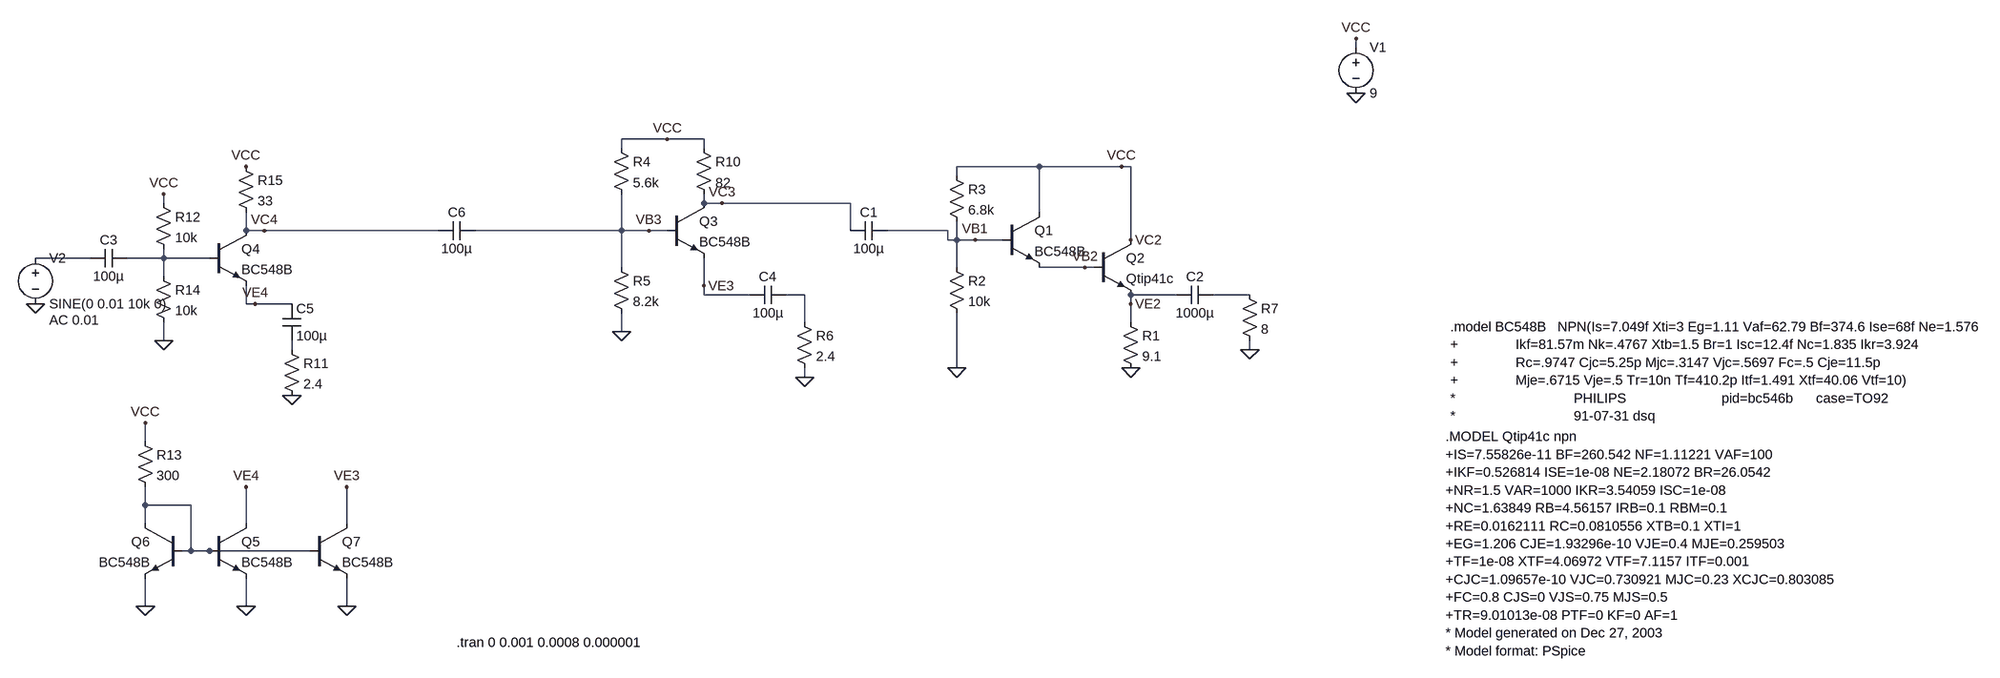
[diagram p0: schematic TL4-Funes.asc]
TL4-Funes.asc, the LTspice schematic file:
Version 4
SHEET 1 1936 816
WIRE 624 -240 624 -256
WIRE -688 -80 -768 -80
WIRE -624 -80 -688 -80
WIRE -768 -64 -768 -80
WIRE -624 -64 -624 -80
WIRE 32 -32 -112 -32
WIRE 176 -32 32 -32
WIRE 192 -32 176 -32
WIRE -112 -16 -112 -32
WIRE -1568 32 -1568 16
WIRE -624 32 -624 16
WIRE -592 32 -624 32
WIRE -368 32 -592 32
WIRE 32 48 32 -32
WIRE -1424 80 -1424 48
WIRE -1392 80 -1424 80
WIRE -1088 80 -1392 80
WIRE -768 80 -768 16
WIRE -768 80 -1024 80
WIRE -720 80 -768 80
WIRE -688 80 -720 80
WIRE -368 80 -368 32
WIRE -128 80 -304 80
WIRE -128 96 -128 80
WIRE -112 96 -112 64
WIRE -112 96 -128 96
WIRE -80 96 -112 96
WIRE -32 96 -80 96
WIRE 192 96 192 -32
WIRE -1696 128 -1792 128
WIRE -1568 128 -1568 112
WIRE -1568 128 -1632 128
WIRE -1488 128 -1568 128
WIRE -768 144 -768 80
WIRE -112 144 -112 96
WIRE 112 144 32 144
WIRE 128 144 112 144
WIRE -1568 160 -1568 128
WIRE -624 176 -624 128
WIRE -624 192 -624 176
WIRE -544 192 -624 192
WIRE -448 192 -480 192
WIRE 272 192 192 192
WIRE 400 192 336 192
WIRE -1424 208 -1424 176
WIRE -1408 208 -1424 208
WIRE -1344 208 -1408 208
WIRE 192 208 192 192
WIRE -448 240 -448 192
WIRE 192 240 192 208
WIRE -768 256 -768 224
WIRE -1568 272 -1568 240
WIRE -1344 288 -1344 272
WIRE 400 288 400 272
WIRE -112 320 -112 224
WIRE -448 336 -448 320
WIRE -1600 448 -1600 416
WIRE -1600 560 -1600 528
WIRE -1520 560 -1600 560
WIRE -1600 592 -1600 560
WIRE -1424 592 -1424 528
WIRE -1248 592 -1248 528
WIRE -1520 640 -1520 560
WIRE -1520 640 -1536 640
WIRE -1488 640 -1520 640
WIRE -1312 640 -1488 640
WIRE -1600 736 -1600 688
WIRE -1424 736 -1424 688
WIRE -1248 736 -1248 688
FLAG 624 -160 0
FLAG 624 -256 VCC
FLAG 176 -32 VCC
FLAG 192 320 0
FLAG -112 320 0
FLAG 112 144 VB2
FLAG -80 96 VB1
FLAG 192 208 VE2
FLAG -768 256 0
FLAG -688 -80 VCC
FLAG -720 80 VB3
FLAG 400 288 0
FLAG 192 96 VC2
FLAG -592 32 VC3
FLAG -624 176 VE3
FLAG -1600 736 0
FLAG -1424 736 0
FLAG -1600 416 VCC
FLAG -1424 528 VE4
FLAG -1408 208 VE4
FLAG -1344 368 0
FLAG -1568 16 VCC
FLAG -1568 272 0
FLAG -1424 -32 VCC
FLAG -1392 80 VC4
FLAG -1792 208 0
FLAG -1248 736 0
FLAG -1248 528 VE3
FLAG -448 336 0
SYMBOL npn 128 96 R0
SYMATTR InstName Q2
SYMATTR Value Qtip41c
SYMBOL npn -32 48 R0
SYMATTR InstName Q1
SYMATTR Value BC548B
SYMBOL voltage 624 -256 R0
WINDOW 123 0 0 Left 2
WINDOW 39 0 0 Left 2
SYMATTR InstName V1
SYMATTR Value 9
SYMBOL res 176 224 R0
SYMATTR InstName R1
SYMATTR Value 9.1
SYMBOL res -128 128 R0
SYMATTR InstName R2
SYMATTR Value 10k
SYMBOL res -128 -32 R0
SYMATTR InstName R3
SYMATTR Value 6.8k
SYMBOL npn -688 32 R0
SYMATTR InstName Q3
SYMATTR Value BC548B
SYMBOL res -784 -80 R0
SYMATTR InstName R4
SYMATTR Value 5.6k
SYMBOL res -784 128 R0
SYMATTR InstName R5
SYMATTR Value 8.2k
SYMBOL voltage -1792 112 R0
WINDOW 123 24 124 Left 2
WINDOW 39 0 0 Left 2
SYMATTR Value2 AC 0.01
SYMATTR InstName V2
SYMATTR Value SINE(0 0.01 10k 0)
SYMBOL res 384 176 R0
SYMATTR InstName R7
SYMATTR Value 8
SYMBOL cap 272 208 R270
WINDOW 0 32 32 VTop 2
WINDOW 3 0 32 VBottom 2
SYMATTR InstName C2
SYMATTR Value 1000µ
SYMBOL cap -304 64 R90
WINDOW 0 0 32 VBottom 2
WINDOW 3 32 32 VTop 2
SYMATTR InstName C1
SYMATTR Value 100µ
SYMBOL res -640 -80 R0
SYMATTR InstName R10
SYMATTR Value 82
SYMBOL npn -1488 80 R0
SYMATTR InstName Q4
SYMATTR Value BC548B
SYMBOL npn -1488 592 R0
SYMATTR InstName Q5
SYMATTR Value BC548B
SYMBOL npn -1536 592 M0
SYMATTR InstName Q6
SYMATTR Value BC548B
SYMBOL res -1616 432 R0
SYMATTR InstName R13
SYMATTR Value 300
SYMBOL cap -1360 208 R0
SYMATTR InstName C5
SYMATTR Value 100µ
SYMBOL res -1360 272 R0
SYMATTR InstName R11
SYMATTR Value 2.4
SYMBOL res -1584 16 R0
SYMATTR InstName R12
SYMATTR Value 10k
SYMBOL res -1584 144 R0
SYMATTR InstName R14
SYMATTR Value 10k
SYMBOL res -1440 -48 R0
SYMATTR InstName R15
SYMATTR Value 33
SYMBOL cap -1632 112 R90
WINDOW 0 0 32 VBottom 2
WINDOW 3 32 32 VTop 2
SYMATTR InstName C3
SYMATTR Value 100µ
SYMBOL npn -1312 592 R0
SYMATTR InstName Q7
SYMATTR Value BC548B
SYMBOL cap -544 208 R270
WINDOW 0 32 32 VTop 2
WINDOW 3 0 32 VBottom 2
SYMATTR InstName C4
SYMATTR Value 100µ
SYMBOL res -464 224 R0
SYMATTR InstName R6
SYMATTR Value 2.4
SYMBOL cap -1088 96 R270
WINDOW 0 32 32 VTop 2
WINDOW 3 0 32 VBottom 2
SYMATTR InstName C6
SYMATTR Value 100µ
TEXT 864 440 Left 2 !.MODEL Qtip41c npn\n+IS=7.55826e-11 BF=260.542 NF=1.11221 VAF=100\n+IKF=0.526814 ISE=1e-08 NE=2.18072 BR=26.0542\n+NR=1.5 VAR=1000 IKR=3.54059 ISC=1e-08\n+NC=1.63849 RB=4.56157 IRB=0.1 RBM=0.1\n+RE=0.0162111 RC=0.0810556 XTB=0.1 XTI=1\n+EG=1.206 CJE=1.93296e-10 VJE=0.4 MJE=0.259503\n+TF=1e-08 XTF=4.06972 VTF=7.1157 ITF=0.001\n+CJC=1.09657e-10 VJC=0.730921 MJC=0.23 XCJC=0.803085\n+FC=0.8 CJS=0 VJS=0.75 MJS=0.5\n+TR=9.01013e-08 PTF=0 KF=0 AF=1\n* Model generated on Dec 27, 2003\n* Model format: PSpice
TEXT 872 248 Left 2 !.model BC548B   NPN(Is=7.049f Xti=3 Eg=1.11 Vaf=62.79 Bf=374.6 Ise=68f Ne=1.576\n+               Ikf=81.57m Nk=.4767 Xtb=1.5 Br=1 Isc=12.4f Nc=1.835 Ikr=3.924\n+               Rc=.9747 Cjc=5.25p Mjc=.3147 Vjc=.5697 Fc=.5 Cje=11.5p\n+               Mje=.6715 Vje=.5 Tr=10n Tf=410.2p Itf=1.491 Xtf=40.06 Vtf=10)\n*                               PHILIPS                         pid=bc546b      case=TO92\n*                               91-07-31 dsq
TEXT -1056 800 Left 2 !.tran 0 0.001 0.0008 0.000001

The netlist it stands for:
* TL4-Funes.asc
Q2 VC2 VB2 VE2 0 Qtip41c
Q1 VC2 VB1 VB2 0 BC548B
V1 VC2 0 9
R1 VE2 0 9.1
R2 VB1 0 10k
R3 VC2 VB1 6.8k
Q3 VC3 VB3 VE3 0 BC548B
R4 VC2 VB3 5.6k
R5 VB3 0 8.2k
V2 N001 0 SINE(0 0.01 10k 0) AC 0.01
R7 N004 0 8
C2 VE2 N004 1000µ
C1 VB1 VC3 100µ
R10 VC2 VC3 82
Q4 VC4 N002 VE4 0 BC548B
Q5 VE4 N006 0 0 BC548B
Q6 N006 N006 0 0 BC548B
R13 VC2 N006 300
C5 VE4 N005 100µ
R11 N005 0 2.4
R12 VC2 N002 10k
R14 N002 0 10k
R15 VC2 VC4 33
C3 N002 N001 100µ
Q7 VE3 N006 0 0 BC548B
C4 VE3 N003 100µ
R6 N003 0 2.4
C6 VC4 VB3 100µ
.model NPN NPN
.model PNP PNP
.lib standard.bjt
.MODEL Qtip41c npn
+IS=7.55826e-11 BF=260.542 NF=1.11221 VAF=100
+IKF=0.526814 ISE=1e-08 NE=2.18072 BR=26.0542
+NR=1.5 VAR=1000 IKR=3.54059 ISC=1e-08
+NC=1.63849 RB=4.56157 IRB=0.1 RBM=0.1
+RE=0.0162111 RC=0.0810556 XTB=0.1 XTI=1
+EG=1.206 CJE=1.93296e-10 VJE=0.4 MJE=0.259503
+TF=1e-08 XTF=4.06972 VTF=7.1157 ITF=0.001
+CJC=1.09657e-10 VJC=0.730921 MJC=0.23 XCJC=0.803085
+FC=0.8 CJS=0 VJS=0.75 MJS=0.5
+TR=9.01013e-08 PTF=0 KF=0 AF=1
* Model generated on Dec 27, 2003
* Model format: PSpice
.model BC548B   NPN(Is=7.049f Xti=3 Eg=1.11 Vaf=62.79 Bf=374.6 Ise=68f Ne=1.576
+               Ikf=81.57m Nk=.4767 Xtb=1.5 Br=1 Isc=12.4f Nc=1.835 Ikr=3.924
+               Rc=.9747 Cjc=5.25p Mjc=.3147 Vjc=.5697 Fc=.5 Cje=11.5p
+               Mje=.6715 Vje=.5 Tr=10n Tf=410.2p Itf=1.491 Xtf=40.06 Vtf=10)
*                               PHILIPS                         pid=bc546b      case=TO92
*                               91-07-31 dsq
.tran 0 0.001 0.0008 0.000001
.backanno
.end